# Altium schematic sheet E51_breakout.SchDoc
size A4; SheetNumber: 1; SheetTotal: 1
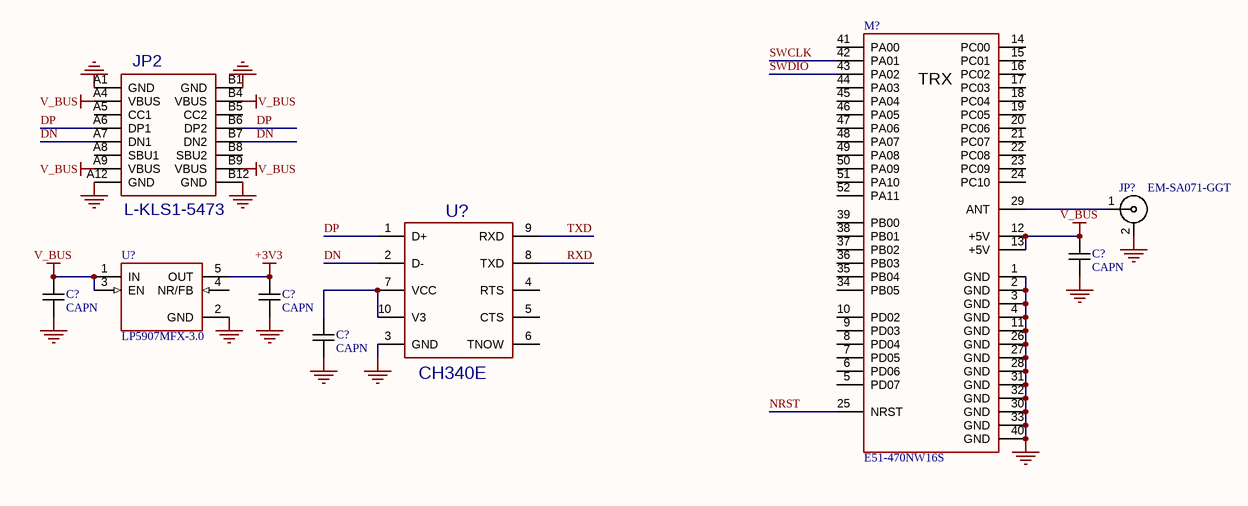
[diagram p0: E51_breakout.SchDoc]

## Parts
(Parts that share a designator on the sheet are numbered #1, #2 ... from top to bottom, then left to right.)
C?#1  CAPN  [C-0603]
C?#2  CAPN  [C-0603]
C?#3  CAPN  [C-0603]
C?#4  CAPN  [C-0603]
JP2  L-KLS1-5473  [L-KLS1-5473]
JP?  EM-SA071-GGT  [AMPHENOL_132357-11]
M?  E51-470NW16S  [E51]
U?#1  CH340E  [MSOP-10]
U?#2  LP5907MFX-3.0  [SOT-23-5]

## Nets
+3V3: C?#3.1 U?#2.5(OUT)
GND: C?#1.2 C?#2.2 C?#3.2 C?#4.2 JP2.A1(GND) JP2.A12(GND) JP2.B1(GND) JP2.B12(GND) JP?.2 M?.1(GND) M?.2(GND) M?.3(GND) M?.4(GND) M?.11(GND) M?.26(GND) M?.27(GND) M?.28(GND) M?.30(GND) M?.31(GND) M?.32(GND) M?.33(GND) M?.40(GND) U?#1.3(GND) U?#2.2(GND)
V_BUS: C?#1.1 C?#2.1 JP2.A4(VBUS) JP2.A9(VBUS) JP2.B4(VBUS) JP2.B9(VBUS) M?.12(+5V) M?.13(+5V) U?#2.1(IN) U?#2.3(EN)
DN: JP2.A7(DN1) JP2.B7(DN2) U?#1.2(D-)
DP: JP2.A6(DP1) JP2.B6(DP2) U?#1.1(D+)
NRST: M?.25(NRST)
RXD: U?#1.8(TXD)
SWCLK: M?.42(PA01)
SWDIO: M?.43(PA02)
TXD: U?#1.9(RXD)
NetC?#4_1: C?#4.1 U?#1.7(VCC) U?#1.10(V3)
NetJP?_1: JP?.1 M?.29(ANT)

Not connected (* = marked no-connect by the designer): JP2 17(VSS) A5(CC1) A8(SBU1) B5(CC2) B8(SBU2); M? 5(PD07) 6(PD06) 7(PD05) 8(PD04) 9(PD03) 10(PD02) 14(PC00) 15(PC01) 16(PC02) 17(PC03) 18(PC04) 19(PC05) 20(PC06) 21(PC07) 22(PC08) 23(PC09) 24(PC10) 34(PB05) 35(PB04) 36(PB03) 37(PB02) 38(PB01) 39(PB00) 41(PA00) 44(PA03) 45(PA04) 46(PA05) 47(PA06) 48(PA07) 49(PA08) 50(PA09) 51(PA10) 52(PA11); U?#1 4(RTS) 5(CTS) 6(TNOW); U?#2 4(NR/FB)

## Notes on the sheet
- (in symbol E51-xxxNW16S) TRX

## Library data of the parts
C?#1-C?#4 = CAPN: Voltage: 50V; Точність/група: NP0; Вид: Конденсатор
JP2 = L-KLS1-5473: Mounting  Method: SMD; Value: *
JP? = SMA: SMA Female R/A PCB Mount; Вид: Роз'єм
M? = E51-xxxNW16S
U?#1 = CH340E: Value: {Value}; Mounting  Method: SMD
U?#2 = LP5907: 250mA Low-Dropout Regulator; Вид: Мікросхема